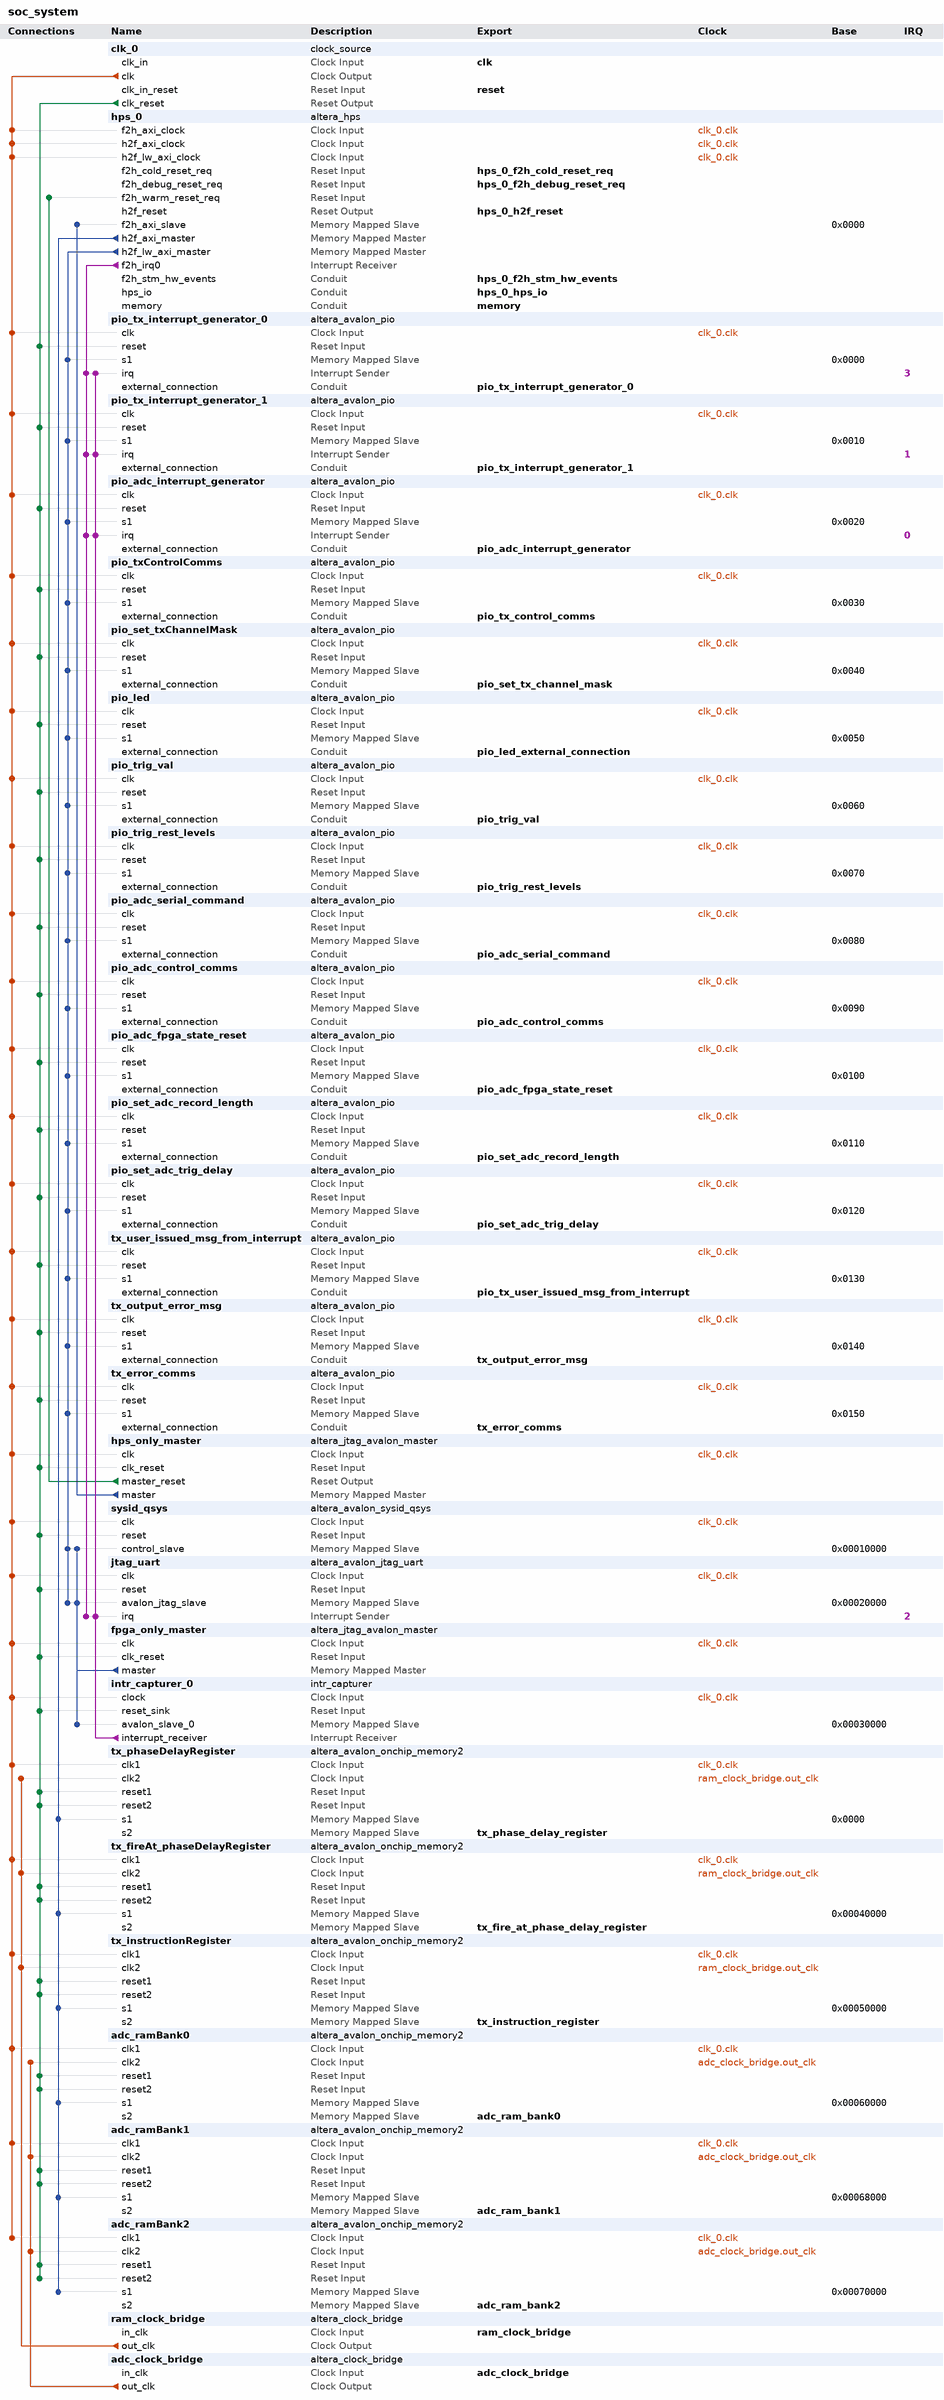
[diagram p0: system contents]
# Platform Designer (Qsys) system soc_system, Cyclone V 5CSEBA6U23I7DK
# Parameters at their usual value, and those the tool derives, are not listed.
package require -exact qsys 17.1
create_system soc_system
set_project_property DEVICE_FAMILY {Cyclone V}
set_project_property DEVICE 5CSEBA6U23I7DK

add_instance clk_0 clock_source 17.1
set_instance_parameter_value clk_0 clockFrequency 50000000

add_instance hps_0 altera_hps 17.1
set_instance_parameter_value hps_0 EMAC1_Mode RGMII
set_instance_parameter_value hps_0 EMAC1_PinMuxing {HPS I/O Set 0}
set_instance_parameter_value hps_0 F2SCLK_COLDRST_Enable true
set_instance_parameter_value hps_0 F2SCLK_DBGRST_Enable true
set_instance_parameter_value hps_0 F2SCLK_WARMRST_Enable true
set_instance_parameter_value hps_0 F2SINTERRUPT_Enable true
set_instance_parameter_value hps_0 F2S_Width 3
set_instance_parameter_value hps_0 FPGA_PERIPHERAL_OUTPUT_CLOCK_FREQ_EMAC0_GTX_CLK 100
set_instance_parameter_value hps_0 FPGA_PERIPHERAL_OUTPUT_CLOCK_FREQ_EMAC0_MD_CLK 100.0
set_instance_parameter_value hps_0 FPGA_PERIPHERAL_OUTPUT_CLOCK_FREQ_EMAC1_GTX_CLK 100
set_instance_parameter_value hps_0 FPGA_PERIPHERAL_OUTPUT_CLOCK_FREQ_EMAC1_MD_CLK 100.0
set_instance_parameter_value hps_0 HPS_PROTOCOL DDR3
set_instance_parameter_value hps_0 I2C0_Mode I2C
set_instance_parameter_value hps_0 I2C0_PinMuxing {HPS I/O Set 0}
set_instance_parameter_value hps_0 I2C1_Mode I2C
set_instance_parameter_value hps_0 I2C1_PinMuxing {HPS I/O Set 0}
set_instance_parameter_value hps_0 LWH2F_Enable true
set_instance_parameter_value hps_0 MEM_BANKADDR_WIDTH 3
set_instance_parameter_value hps_0 MEM_CLK_FREQ 400.0
set_instance_parameter_value hps_0 MEM_COL_ADDR_WIDTH 10
set_instance_parameter_value hps_0 MEM_DQ_WIDTH 32
set_instance_parameter_value hps_0 MEM_DRV_STR RZQ/6
set_instance_parameter_value hps_0 MEM_ROW_ADDR_WIDTH 15
set_instance_parameter_value hps_0 MEM_RTT_NOM RZQ/6
set_instance_parameter_value hps_0 MEM_RTT_WR {Dynamic ODT off}
set_instance_parameter_value hps_0 MEM_TCL 7
set_instance_parameter_value hps_0 MEM_TFAW_NS 37.5
set_instance_parameter_value hps_0 MEM_TRAS_NS 35.0
set_instance_parameter_value hps_0 MEM_TRCD_NS 13.75
set_instance_parameter_value hps_0 MEM_TRFC_NS 300.0
set_instance_parameter_value hps_0 MEM_TRP_NS 13.75
set_instance_parameter_value hps_0 MEM_VENDOR Other
set_instance_parameter_value hps_0 MEM_WTCL 7
set_instance_parameter_value hps_0 QSPI_Mode N/A
set_instance_parameter_value hps_0 QSPI_PinMuxing Unused
set_instance_parameter_value hps_0 REF_CLK_FREQ 400.0
set_instance_parameter_value hps_0 S2FCLK_USER2CLK 5
set_instance_parameter_value hps_0 S2F_Width 2
set_instance_parameter_value hps_0 SDIO_Mode {4-bit Data}
set_instance_parameter_value hps_0 SDIO_PinMuxing {HPS I/O Set 0}
set_instance_parameter_value hps_0 SPIM1_Mode {Single Slave Select}
set_instance_parameter_value hps_0 SPIM1_PinMuxing {HPS I/O Set 0}
set_instance_parameter_value hps_0 STM_Enable true
set_instance_parameter_value hps_0 TIMING_BOARD_AC_SKEW 0.02
set_instance_parameter_value hps_0 TIMING_BOARD_AC_TO_CK_SKEW 0.0
set_instance_parameter_value hps_0 TIMING_BOARD_DQ_TO_DQS_SKEW 0.0
set_instance_parameter_value hps_0 TIMING_BOARD_MAX_CK_DELAY 0.6
set_instance_parameter_value hps_0 TIMING_BOARD_MAX_DQS_DELAY 0.6
set_instance_parameter_value hps_0 TIMING_BOARD_SKEW_BETWEEN_DQS 0.02
set_instance_parameter_value hps_0 TIMING_BOARD_SKEW_CKDQS_DIMM_MAX 0.01
set_instance_parameter_value hps_0 TIMING_BOARD_SKEW_CKDQS_DIMM_MIN -0.01
set_instance_parameter_value hps_0 TIMING_BOARD_SKEW_WITHIN_DQS 0.02
set_instance_parameter_value hps_0 TIMING_TDH 125
set_instance_parameter_value hps_0 TIMING_TDQSCK 400
set_instance_parameter_value hps_0 TIMING_TDQSQ 120
set_instance_parameter_value hps_0 TIMING_TDS 50
set_instance_parameter_value hps_0 TIMING_TIH 250
set_instance_parameter_value hps_0 TIMING_TIS 175
set_instance_parameter_value hps_0 TIMING_TQSH 0.38
set_instance_parameter_value hps_0 UART0_Mode {No Flow Control}
set_instance_parameter_value hps_0 UART0_PinMuxing {HPS I/O Set 0}
set_instance_parameter_value hps_0 USB1_Mode SDR
set_instance_parameter_value hps_0 USB1_PinMuxing {HPS I/O Set 0}
set_instance_parameter_value hps_0 desired_cfg_clk_mhz 50.0
set_instance_parameter_value hps_0 desired_qspi_clk_mhz 370.0

add_instance pio_tx_interrupt_generator_0 altera_avalon_pio 17.1
set_instance_parameter_value pio_tx_interrupt_generator_0 bitClearingEdgeCapReg true
set_instance_parameter_value pio_tx_interrupt_generator_0 captureEdge true
set_instance_parameter_value pio_tx_interrupt_generator_0 direction Input
set_instance_parameter_value pio_tx_interrupt_generator_0 generateIRQ true
set_instance_parameter_value pio_tx_interrupt_generator_0 irqType EDGE
set_instance_parameter_value pio_tx_interrupt_generator_0 width 32

add_instance pio_tx_interrupt_generator_1 altera_avalon_pio 17.1
set_instance_parameter_value pio_tx_interrupt_generator_1 bitClearingEdgeCapReg true
set_instance_parameter_value pio_tx_interrupt_generator_1 captureEdge true
set_instance_parameter_value pio_tx_interrupt_generator_1 direction Input
set_instance_parameter_value pio_tx_interrupt_generator_1 generateIRQ true
set_instance_parameter_value pio_tx_interrupt_generator_1 irqType EDGE
set_instance_parameter_value pio_tx_interrupt_generator_1 width 32

add_instance pio_adc_interrupt_generator altera_avalon_pio 17.1
set_instance_parameter_value pio_adc_interrupt_generator bitClearingEdgeCapReg true
set_instance_parameter_value pio_adc_interrupt_generator captureEdge true
set_instance_parameter_value pio_adc_interrupt_generator direction Input
set_instance_parameter_value pio_adc_interrupt_generator generateIRQ true
set_instance_parameter_value pio_adc_interrupt_generator irqType EDGE
set_instance_parameter_value pio_adc_interrupt_generator width 8

add_instance pio_txControlComms altera_avalon_pio 17.1
set_instance_parameter_value pio_txControlComms direction Output
set_instance_parameter_value pio_txControlComms width 8

add_instance pio_set_txChannelMask altera_avalon_pio 17.1
set_instance_parameter_value pio_set_txChannelMask direction Output
set_instance_parameter_value pio_set_txChannelMask width 8

add_instance pio_led altera_avalon_pio 17.1
set_instance_parameter_value pio_led direction Output
set_instance_parameter_value pio_led resetValue 255
set_instance_parameter_value pio_led width 8

add_instance pio_trig_val altera_avalon_pio 17.1
set_instance_parameter_value pio_trig_val direction Output
set_instance_parameter_value pio_trig_val resetValue 255
set_instance_parameter_value pio_trig_val width 8

add_instance pio_trig_rest_levels altera_avalon_pio 17.1
set_instance_parameter_value pio_trig_rest_levels direction Output
set_instance_parameter_value pio_trig_rest_levels resetValue 255
set_instance_parameter_value pio_trig_rest_levels width 8

add_instance pio_adc_serial_command altera_avalon_pio 17.1
set_instance_parameter_value pio_adc_serial_command direction Output
set_instance_parameter_value pio_adc_serial_command width 24

add_instance pio_adc_control_comms altera_avalon_pio 17.1
set_instance_parameter_value pio_adc_control_comms direction Output
set_instance_parameter_value pio_adc_control_comms width 8

add_instance pio_adc_fpga_state_reset altera_avalon_pio 17.1
set_instance_parameter_value pio_adc_fpga_state_reset direction Output
set_instance_parameter_value pio_adc_fpga_state_reset width 1

add_instance pio_set_adc_record_length altera_avalon_pio 17.1
set_instance_parameter_value pio_set_adc_record_length direction Output
set_instance_parameter_value pio_set_adc_record_length width 13

add_instance pio_set_adc_trig_delay altera_avalon_pio 17.1
set_instance_parameter_value pio_set_adc_trig_delay direction Output
set_instance_parameter_value pio_set_adc_trig_delay width 32

add_instance tx_user_issued_msg_from_interrupt altera_avalon_pio 17.1
set_instance_parameter_value tx_user_issued_msg_from_interrupt direction Input
set_instance_parameter_value tx_user_issued_msg_from_interrupt width 32

add_instance tx_output_error_msg altera_avalon_pio 17.1
set_instance_parameter_value tx_output_error_msg direction Input
set_instance_parameter_value tx_output_error_msg width 8

add_instance tx_error_comms altera_avalon_pio 17.1
set_instance_parameter_value tx_error_comms direction Output
set_instance_parameter_value tx_error_comms width 32

add_instance hps_only_master altera_jtag_avalon_master 17.1

add_instance sysid_qsys altera_avalon_sysid_qsys 17.1
set_instance_parameter_value sysid_qsys id -1395322110

add_instance jtag_uart altera_avalon_jtag_uart 17.1
set_instance_parameter_value jtag_uart allowMultipleConnections true
set_instance_parameter_value jtag_uart simInteractiveOptions INTERACTIVE_ASCII_OUTPUT

add_instance fpga_only_master altera_jtag_avalon_master 17.1

add_instance intr_capturer_0 intr_capturer 100.99.98.97

add_instance tx_phaseDelayRegister altera_avalon_onchip_memory2 17.1
set_instance_parameter_value tx_phaseDelayRegister dataWidth 128
set_instance_parameter_value tx_phaseDelayRegister dualPort true
set_instance_parameter_value tx_phaseDelayRegister initMemContent true
set_instance_parameter_value tx_phaseDelayRegister initializationFileName onchip_mem.hex
set_instance_parameter_value tx_phaseDelayRegister memorySize 262144

add_instance tx_fireAt_phaseDelayRegister altera_avalon_onchip_memory2 17.1
set_instance_parameter_value tx_fireAt_phaseDelayRegister dataWidth 128
set_instance_parameter_value tx_fireAt_phaseDelayRegister dualPort true
set_instance_parameter_value tx_fireAt_phaseDelayRegister initMemContent true
set_instance_parameter_value tx_fireAt_phaseDelayRegister initializationFileName onchip_mem.hex
set_instance_parameter_value tx_fireAt_phaseDelayRegister memorySize 65536

add_instance tx_instructionRegister altera_avalon_onchip_memory2 17.1
set_instance_parameter_value tx_instructionRegister dataWidth 64
set_instance_parameter_value tx_instructionRegister dualPort true
set_instance_parameter_value tx_instructionRegister initMemContent true
set_instance_parameter_value tx_instructionRegister initializationFileName onchip_mem.hex
set_instance_parameter_value tx_instructionRegister memorySize 65536

add_instance adc_ramBank0 altera_avalon_onchip_memory2 17.1
set_instance_parameter_value adc_ramBank0 dataWidth 32
set_instance_parameter_value adc_ramBank0 dualPort true
set_instance_parameter_value adc_ramBank0 initMemContent true
set_instance_parameter_value adc_ramBank0 initializationFileName onchip_mem.hex
set_instance_parameter_value adc_ramBank0 memorySize 32768

add_instance adc_ramBank1 altera_avalon_onchip_memory2 17.1
set_instance_parameter_value adc_ramBank1 dataWidth 32
set_instance_parameter_value adc_ramBank1 dualPort true
set_instance_parameter_value adc_ramBank1 initMemContent true
set_instance_parameter_value adc_ramBank1 initializationFileName onchip_mem.hex
set_instance_parameter_value adc_ramBank1 memorySize 32768

add_instance adc_ramBank2 altera_avalon_onchip_memory2 17.1
set_instance_parameter_value adc_ramBank2 dataWidth 32
set_instance_parameter_value adc_ramBank2 dualPort true
set_instance_parameter_value adc_ramBank2 initMemContent true
set_instance_parameter_value adc_ramBank2 initializationFileName onchip_mem.hex
set_instance_parameter_value adc_ramBank2 memorySize 32768

add_instance ram_clock_bridge altera_clock_bridge 17.1
set_instance_parameter_value ram_clock_bridge DERIVED_CLOCK_RATE 0
set_instance_parameter_value ram_clock_bridge EXPLICIT_CLOCK_RATE 200000000

add_instance adc_clock_bridge altera_clock_bridge 17.1
set_instance_parameter_value adc_clock_bridge DERIVED_CLOCK_RATE 0
set_instance_parameter_value adc_clock_bridge EXPLICIT_CLOCK_RATE 25000000

# connections
add_connection adc_clock_bridge.out_clk adc_ramBank0.clk2 clock
add_connection adc_clock_bridge.out_clk adc_ramBank1.clk2 clock
add_connection adc_clock_bridge.out_clk adc_ramBank2.clk2 clock
add_connection clk_0.clk adc_ramBank0.clk1 clock
add_connection clk_0.clk adc_ramBank1.clk1 clock
add_connection clk_0.clk adc_ramBank2.clk1 clock
add_connection clk_0.clk fpga_only_master.clk clock
add_connection clk_0.clk hps_0.f2h_axi_clock clock
add_connection clk_0.clk hps_0.h2f_axi_clock clock
add_connection clk_0.clk hps_0.h2f_lw_axi_clock clock
add_connection clk_0.clk hps_only_master.clk clock
add_connection clk_0.clk intr_capturer_0.clock clock
add_connection clk_0.clk jtag_uart.clk clock
add_connection clk_0.clk pio_adc_control_comms.clk clock
add_connection clk_0.clk pio_adc_fpga_state_reset.clk clock
add_connection clk_0.clk pio_adc_interrupt_generator.clk clock
add_connection clk_0.clk pio_adc_serial_command.clk clock
add_connection clk_0.clk pio_led.clk clock
add_connection clk_0.clk pio_set_adc_record_length.clk clock
add_connection clk_0.clk pio_set_adc_trig_delay.clk clock
add_connection clk_0.clk pio_set_txChannelMask.clk clock
add_connection clk_0.clk pio_trig_rest_levels.clk clock
add_connection clk_0.clk pio_trig_val.clk clock
add_connection clk_0.clk pio_tx_interrupt_generator_0.clk clock
add_connection clk_0.clk pio_tx_interrupt_generator_1.clk clock
add_connection clk_0.clk pio_txControlComms.clk clock
add_connection clk_0.clk sysid_qsys.clk clock
add_connection clk_0.clk tx_error_comms.clk clock
add_connection clk_0.clk tx_fireAt_phaseDelayRegister.clk1 clock
add_connection clk_0.clk tx_instructionRegister.clk1 clock
add_connection clk_0.clk tx_output_error_msg.clk clock
add_connection clk_0.clk tx_phaseDelayRegister.clk1 clock
add_connection clk_0.clk tx_user_issued_msg_from_interrupt.clk clock
add_connection ram_clock_bridge.out_clk tx_fireAt_phaseDelayRegister.clk2 clock
add_connection ram_clock_bridge.out_clk tx_instructionRegister.clk2 clock
add_connection ram_clock_bridge.out_clk tx_phaseDelayRegister.clk2 clock
add_connection clk_0.clk_reset adc_ramBank0.reset1 reset
add_connection clk_0.clk_reset adc_ramBank0.reset2 reset
add_connection clk_0.clk_reset adc_ramBank1.reset1 reset
add_connection clk_0.clk_reset adc_ramBank1.reset2 reset
add_connection clk_0.clk_reset adc_ramBank2.reset1 reset
add_connection clk_0.clk_reset adc_ramBank2.reset2 reset
add_connection clk_0.clk_reset fpga_only_master.clk_reset reset
add_connection clk_0.clk_reset hps_only_master.clk_reset reset
add_connection clk_0.clk_reset intr_capturer_0.reset_sink reset
add_connection clk_0.clk_reset jtag_uart.reset reset
add_connection clk_0.clk_reset pio_adc_control_comms.reset reset
add_connection clk_0.clk_reset pio_adc_fpga_state_reset.reset reset
add_connection clk_0.clk_reset pio_adc_interrupt_generator.reset reset
add_connection clk_0.clk_reset pio_adc_serial_command.reset reset
add_connection clk_0.clk_reset pio_led.reset reset
add_connection clk_0.clk_reset pio_set_adc_record_length.reset reset
add_connection clk_0.clk_reset pio_set_adc_trig_delay.reset reset
add_connection clk_0.clk_reset pio_set_txChannelMask.reset reset
add_connection clk_0.clk_reset pio_trig_rest_levels.reset reset
add_connection clk_0.clk_reset pio_trig_val.reset reset
add_connection clk_0.clk_reset pio_tx_interrupt_generator_0.reset reset
add_connection clk_0.clk_reset pio_tx_interrupt_generator_1.reset reset
add_connection clk_0.clk_reset pio_txControlComms.reset reset
add_connection clk_0.clk_reset sysid_qsys.reset reset
add_connection clk_0.clk_reset tx_error_comms.reset reset
add_connection clk_0.clk_reset tx_fireAt_phaseDelayRegister.reset1 reset
add_connection clk_0.clk_reset tx_fireAt_phaseDelayRegister.reset2 reset
add_connection clk_0.clk_reset tx_instructionRegister.reset1 reset
add_connection clk_0.clk_reset tx_instructionRegister.reset2 reset
add_connection clk_0.clk_reset tx_output_error_msg.reset reset
add_connection clk_0.clk_reset tx_phaseDelayRegister.reset1 reset
add_connection clk_0.clk_reset tx_phaseDelayRegister.reset2 reset
add_connection clk_0.clk_reset tx_user_issued_msg_from_interrupt.reset reset
add_connection hps_only_master.master_reset hps_0.f2h_warm_reset_req reset
add_connection fpga_only_master.master intr_capturer_0.avalon_slave_0 avalon
set_connection_parameter_value fpga_only_master.master/intr_capturer_0.avalon_slave_0 baseAddress 0x00030000
add_connection fpga_only_master.master jtag_uart.avalon_jtag_slave avalon
set_connection_parameter_value fpga_only_master.master/jtag_uart.avalon_jtag_slave baseAddress 0x00020000
add_connection fpga_only_master.master sysid_qsys.control_slave avalon
set_connection_parameter_value fpga_only_master.master/sysid_qsys.control_slave baseAddress 0x00010000
add_connection hps_0.h2f_axi_master adc_ramBank0.s1 avalon
set_connection_parameter_value hps_0.h2f_axi_master/adc_ramBank0.s1 baseAddress 0x00060000
add_connection hps_0.h2f_axi_master adc_ramBank1.s1 avalon
set_connection_parameter_value hps_0.h2f_axi_master/adc_ramBank1.s1 baseAddress 0x00068000
add_connection hps_0.h2f_axi_master adc_ramBank2.s1 avalon
set_connection_parameter_value hps_0.h2f_axi_master/adc_ramBank2.s1 baseAddress 0x00070000
add_connection hps_0.h2f_axi_master tx_fireAt_phaseDelayRegister.s1 avalon
set_connection_parameter_value hps_0.h2f_axi_master/tx_fireAt_phaseDelayRegister.s1 baseAddress 0x00040000
add_connection hps_0.h2f_axi_master tx_instructionRegister.s1 avalon
set_connection_parameter_value hps_0.h2f_axi_master/tx_instructionRegister.s1 baseAddress 0x00050000
add_connection hps_0.h2f_axi_master tx_phaseDelayRegister.s1 avalon
set_connection_parameter_value hps_0.h2f_axi_master/tx_phaseDelayRegister.s1 baseAddress 0x0000
add_connection hps_0.h2f_lw_axi_master jtag_uart.avalon_jtag_slave avalon
set_connection_parameter_value hps_0.h2f_lw_axi_master/jtag_uart.avalon_jtag_slave baseAddress 0x00020000
add_connection hps_0.h2f_lw_axi_master pio_adc_control_comms.s1 avalon
set_connection_parameter_value hps_0.h2f_lw_axi_master/pio_adc_control_comms.s1 baseAddress 0x0090
add_connection hps_0.h2f_lw_axi_master pio_adc_fpga_state_reset.s1 avalon
set_connection_parameter_value hps_0.h2f_lw_axi_master/pio_adc_fpga_state_reset.s1 baseAddress 0x0100
add_connection hps_0.h2f_lw_axi_master pio_adc_interrupt_generator.s1 avalon
set_connection_parameter_value hps_0.h2f_lw_axi_master/pio_adc_interrupt_generator.s1 baseAddress 0x0020
add_connection hps_0.h2f_lw_axi_master pio_adc_serial_command.s1 avalon
set_connection_parameter_value hps_0.h2f_lw_axi_master/pio_adc_serial_command.s1 baseAddress 0x0080
add_connection hps_0.h2f_lw_axi_master pio_led.s1 avalon
set_connection_parameter_value hps_0.h2f_lw_axi_master/pio_led.s1 baseAddress 0x0050
add_connection hps_0.h2f_lw_axi_master pio_set_adc_record_length.s1 avalon
set_connection_parameter_value hps_0.h2f_lw_axi_master/pio_set_adc_record_length.s1 baseAddress 0x0110
add_connection hps_0.h2f_lw_axi_master pio_set_adc_trig_delay.s1 avalon
set_connection_parameter_value hps_0.h2f_lw_axi_master/pio_set_adc_trig_delay.s1 baseAddress 0x0120
add_connection hps_0.h2f_lw_axi_master pio_set_txChannelMask.s1 avalon
set_connection_parameter_value hps_0.h2f_lw_axi_master/pio_set_txChannelMask.s1 baseAddress 0x0040
add_connection hps_0.h2f_lw_axi_master pio_trig_rest_levels.s1 avalon
set_connection_parameter_value hps_0.h2f_lw_axi_master/pio_trig_rest_levels.s1 baseAddress 0x0070
add_connection hps_0.h2f_lw_axi_master pio_trig_val.s1 avalon
set_connection_parameter_value hps_0.h2f_lw_axi_master/pio_trig_val.s1 baseAddress 0x0060
add_connection hps_0.h2f_lw_axi_master pio_tx_interrupt_generator_0.s1 avalon
set_connection_parameter_value hps_0.h2f_lw_axi_master/pio_tx_interrupt_generator_0.s1 baseAddress 0x0000
add_connection hps_0.h2f_lw_axi_master pio_tx_interrupt_generator_1.s1 avalon
set_connection_parameter_value hps_0.h2f_lw_axi_master/pio_tx_interrupt_generator_1.s1 baseAddress 0x0010
add_connection hps_0.h2f_lw_axi_master pio_txControlComms.s1 avalon
set_connection_parameter_value hps_0.h2f_lw_axi_master/pio_txControlComms.s1 baseAddress 0x0030
add_connection hps_0.h2f_lw_axi_master sysid_qsys.control_slave avalon
set_connection_parameter_value hps_0.h2f_lw_axi_master/sysid_qsys.control_slave baseAddress 0x00010000
add_connection hps_0.h2f_lw_axi_master tx_error_comms.s1 avalon
set_connection_parameter_value hps_0.h2f_lw_axi_master/tx_error_comms.s1 baseAddress 0x0150
add_connection hps_0.h2f_lw_axi_master tx_output_error_msg.s1 avalon
set_connection_parameter_value hps_0.h2f_lw_axi_master/tx_output_error_msg.s1 baseAddress 0x0140
add_connection hps_0.h2f_lw_axi_master tx_user_issued_msg_from_interrupt.s1 avalon
set_connection_parameter_value hps_0.h2f_lw_axi_master/tx_user_issued_msg_from_interrupt.s1 baseAddress 0x0130
add_connection hps_only_master.master hps_0.f2h_axi_slave avalon
set_connection_parameter_value hps_only_master.master/hps_0.f2h_axi_slave baseAddress 0x0000
add_connection hps_0.f2h_irq0 jtag_uart.irq interrupt
set_connection_parameter_value hps_0.f2h_irq0/jtag_uart.irq irqNumber 2
add_connection hps_0.f2h_irq0 pio_adc_interrupt_generator.irq interrupt
set_connection_parameter_value hps_0.f2h_irq0/pio_adc_interrupt_generator.irq irqNumber 0
add_connection hps_0.f2h_irq0 pio_tx_interrupt_generator_0.irq interrupt
set_connection_parameter_value hps_0.f2h_irq0/pio_tx_interrupt_generator_0.irq irqNumber 3
add_connection hps_0.f2h_irq0 pio_tx_interrupt_generator_1.irq interrupt
set_connection_parameter_value hps_0.f2h_irq0/pio_tx_interrupt_generator_1.irq irqNumber 1
add_connection intr_capturer_0.interrupt_receiver jtag_uart.irq interrupt
set_connection_parameter_value intr_capturer_0.interrupt_receiver/jtag_uart.irq irqNumber 2
add_connection intr_capturer_0.interrupt_receiver pio_adc_interrupt_generator.irq interrupt
set_connection_parameter_value intr_capturer_0.interrupt_receiver/pio_adc_interrupt_generator.irq irqNumber 0
add_connection intr_capturer_0.interrupt_receiver pio_tx_interrupt_generator_0.irq interrupt
set_connection_parameter_value intr_capturer_0.interrupt_receiver/pio_tx_interrupt_generator_0.irq irqNumber 3
add_connection intr_capturer_0.interrupt_receiver pio_tx_interrupt_generator_1.irq interrupt
set_connection_parameter_value intr_capturer_0.interrupt_receiver/pio_tx_interrupt_generator_1.irq irqNumber 1

# exported interfaces
add_interface adc_clock_bridge clock sink
set_interface_property adc_clock_bridge EXPORT_OF adc_clock_bridge.in_clk
add_interface adc_ram_bank0 avalon slave
set_interface_property adc_ram_bank0 EXPORT_OF adc_ramBank0.s2
add_interface adc_ram_bank1 avalon slave
set_interface_property adc_ram_bank1 EXPORT_OF adc_ramBank1.s2
add_interface adc_ram_bank2 avalon slave
set_interface_property adc_ram_bank2 EXPORT_OF adc_ramBank2.s2
add_interface clk clock sink
set_interface_property clk EXPORT_OF clk_0.clk_in
add_interface hps_0_f2h_cold_reset_req reset sink
set_interface_property hps_0_f2h_cold_reset_req EXPORT_OF hps_0.f2h_cold_reset_req
add_interface hps_0_f2h_debug_reset_req reset sink
set_interface_property hps_0_f2h_debug_reset_req EXPORT_OF hps_0.f2h_debug_reset_req
add_interface hps_0_f2h_stm_hw_events conduit end
set_interface_property hps_0_f2h_stm_hw_events EXPORT_OF hps_0.f2h_stm_hw_events
add_interface hps_0_h2f_reset reset source
set_interface_property hps_0_h2f_reset EXPORT_OF hps_0.h2f_reset
add_interface hps_0_hps_io conduit end
set_interface_property hps_0_hps_io EXPORT_OF hps_0.hps_io
add_interface memory conduit end
set_interface_property memory EXPORT_OF hps_0.memory
add_interface pio_adc_control_comms conduit end
set_interface_property pio_adc_control_comms EXPORT_OF pio_adc_control_comms.external_connection
add_interface pio_adc_fpga_state_reset conduit end
set_interface_property pio_adc_fpga_state_reset EXPORT_OF pio_adc_fpga_state_reset.external_connection
add_interface pio_adc_interrupt_generator conduit end
set_interface_property pio_adc_interrupt_generator EXPORT_OF pio_adc_interrupt_generator.external_connection
add_interface pio_adc_serial_command conduit end
set_interface_property pio_adc_serial_command EXPORT_OF pio_adc_serial_command.external_connection
add_interface pio_led_external_connection conduit end
set_interface_property pio_led_external_connection EXPORT_OF pio_led.external_connection
add_interface pio_set_adc_record_length conduit end
set_interface_property pio_set_adc_record_length EXPORT_OF pio_set_adc_record_length.external_connection
add_interface pio_set_adc_trig_delay conduit end
set_interface_property pio_set_adc_trig_delay EXPORT_OF pio_set_adc_trig_delay.external_connection
add_interface pio_set_tx_channel_mask conduit end
set_interface_property pio_set_tx_channel_mask EXPORT_OF pio_set_txChannelMask.external_connection
add_interface pio_trig_rest_levels conduit end
set_interface_property pio_trig_rest_levels EXPORT_OF pio_trig_rest_levels.external_connection
add_interface pio_trig_val conduit end
set_interface_property pio_trig_val EXPORT_OF pio_trig_val.external_connection
add_interface pio_tx_control_comms conduit end
set_interface_property pio_tx_control_comms EXPORT_OF pio_txControlComms.external_connection
add_interface pio_tx_interrupt_generator_0 conduit end
set_interface_property pio_tx_interrupt_generator_0 EXPORT_OF pio_tx_interrupt_generator_0.external_connection
add_interface pio_tx_interrupt_generator_1 conduit end
set_interface_property pio_tx_interrupt_generator_1 EXPORT_OF pio_tx_interrupt_generator_1.external_connection
add_interface pio_tx_user_issued_msg_from_interrupt conduit end
set_interface_property pio_tx_user_issued_msg_from_interrupt EXPORT_OF tx_user_issued_msg_from_interrupt.external_connection
add_interface ram_clock_bridge clock sink
set_interface_property ram_clock_bridge EXPORT_OF ram_clock_bridge.in_clk
add_interface reset reset sink
set_interface_property reset EXPORT_OF clk_0.clk_in_reset
add_interface tx_error_comms conduit end
set_interface_property tx_error_comms EXPORT_OF tx_error_comms.external_connection
add_interface tx_fire_at_phase_delay_register avalon slave
set_interface_property tx_fire_at_phase_delay_register EXPORT_OF tx_fireAt_phaseDelayRegister.s2
add_interface tx_instruction_register avalon slave
set_interface_property tx_instruction_register EXPORT_OF tx_instructionRegister.s2
add_interface tx_output_error_msg conduit end
set_interface_property tx_output_error_msg EXPORT_OF tx_output_error_msg.external_connection
add_interface tx_phase_delay_register avalon slave
set_interface_property tx_phase_delay_register EXPORT_OF tx_phaseDelayRegister.s2

set_interconnect_requirement {$system} qsys_mm.clockCrossingAdapter HANDSHAKE
set_interconnect_requirement {$system} qsys_mm.maxAdditionalLatency 1

save_system soc_system.qsys
